# Altium schematic sheet ASSB_FireflyX1.SchDoc
size A4
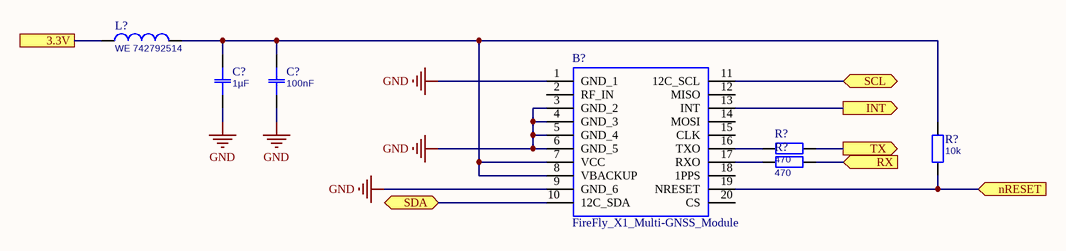
[diagram p0: ASSB_FireflyX1.SchDoc]

## Parts
(Parts that share a designator on the sheet are numbered #1, #2 ... from top to bottom, then left to right.)
B?  FireFly_X1_Multi-GNSS_Module  [X-1]
C?#1  1µF  [0603]
C?#2  100nF  [0603]
L?  WE 742792514  [1812]
R?#1  470  [0603]
R?#2  470  [0603]
R?#3  10k  [0603]

## Ports
3.3V, INT (out), nRESET (in), RX (in), SCL (bidir), SDA (bidir), TX (out)

## Nets
GND: B?.1(GND_1) B?.3(GND_2) B?.4(GND_3) B?.5(GND_4) B?.6(GND_5) B?.9(GND_6) C?#1.1 C?#2.1
3.3V: L?.1 ; port 3.3V
INT: B?.13(INT) ; port INT
nRESET: B?.19(NRESET) R?#3.1 ; port nRESET
RX: R?#2.2 ; port RX
SCL: B?.11(12C_SCL) ; port SCL
SDA: B?.10(12C_SDA) ; port SDA
TX: R?#1.2 ; port TX
NetB?_7: B?.7(VCC) B?.8(VBACKUP) C?#1.2 C?#2.2 L?.2 R?#3.2
NetB?_16: B?.16(TXO) R?#1.1
NetB?_17: B?.17(RXO) R?#2.1

Not connected (* = marked no-connect by the designer): B? 2(RF_IN) 12(MISO) 14(MOSI) 15(CLK) 18(1PPS) 20(CS)

## Library data of the parts
B? = FireFly_X1_Multi-GNSS_Module: Dual system GNSS receiver Module, QFN-20; Manufacturer_Name: GlobalTop Technology Inc.; Manufacturer_Part_Number: FireFly X1 Multi-GNSS Module; RS Part Number: *; RS Price/Stock: *; Arrow Part Number: FireFly X1 Multi-GNSS Module; Arrow Price/Stock: *; Datasheet Link: http://www.gtop-tech.com/manage/upload/product/1460546926_57255.pdf
C?#1 C?#2 = Capacitor: Partnumber: ?; Value: ?
L? = Inductor: Partnumber: ?; Value: ?
R?#1-R?#3 = Resistor: Partnumber: ?; Value: ?